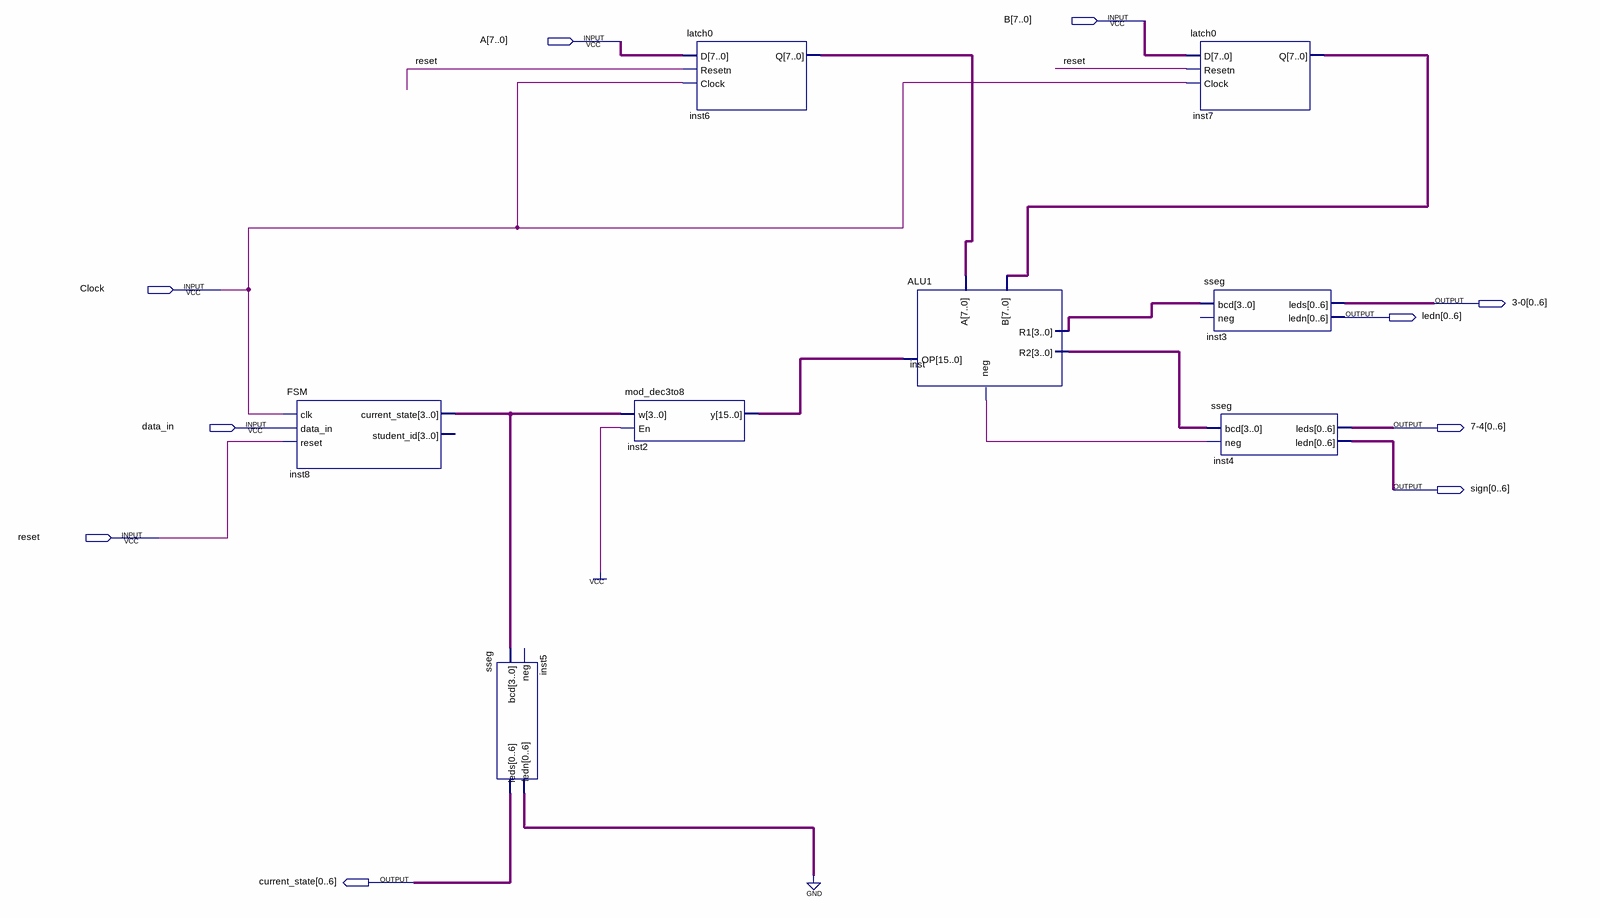
[diagram p0: schematic sheet]
// Quartus schematic prob1.bdf as structural Verilog: 8 symbols, 10 pins
module prob1 (
  input  [7:0] B,
  input  [7:0] A,
  input  Clock,
  input  data_in,
  input  reset,
  output [0:6] \3-0 ,
  output [0:6] ledn,
  output [0:6] \7-4 ,
  output [0:6] sign,
  output [0:6] current_state
);

  wire inst_neg;
  wire [3:0] inst8_current_state, inst_r1, inst_r2;
  wire [6:0] inst5_ledn;
  wire [7:0] inst6_q, inst7_q;
  wire [15:0] inst2_y;

  FSM inst8 (.clk(Clock), .data_in(data_in), .reset(reset), .current_state(inst8_current_state));  // open: student_id
  sseg inst5 (.bcd(inst8_current_state), .leds(current_state), .ledn(inst5_ledn));  // open: neg
  mod_dec3to8 inst2 (.w(inst8_current_state), .En(1'b1), .y(inst2_y));
  latch0 inst6 (.D(A), .Resetn(reset), .Clock(Clock), .Q(inst6_q));
  ALU1 inst (.A(inst6_q), .B(inst7_q), .OP(inst2_y), .neg(inst_neg), .R1(inst_r1), .R2(inst_r2));
  latch0 inst7 (.D(B), .Resetn(reset), .Clock(Clock), .Q(inst7_q));
  sseg inst3 (.bcd(inst_r1), .leds(\3-0 ), .ledn(ledn));  // open: neg
  sseg inst4 (.bcd(inst_r2), .neg(inst_neg), .leds(\7-4 ), .ledn(sign));
  // also tied to GND on the sheet: {inst5_ledn[0], inst5_ledn[1], inst5_ledn[2], inst5_ledn[3], inst5_ledn[4], inst5_ledn[5], inst5_ledn[6]}
endmodule
